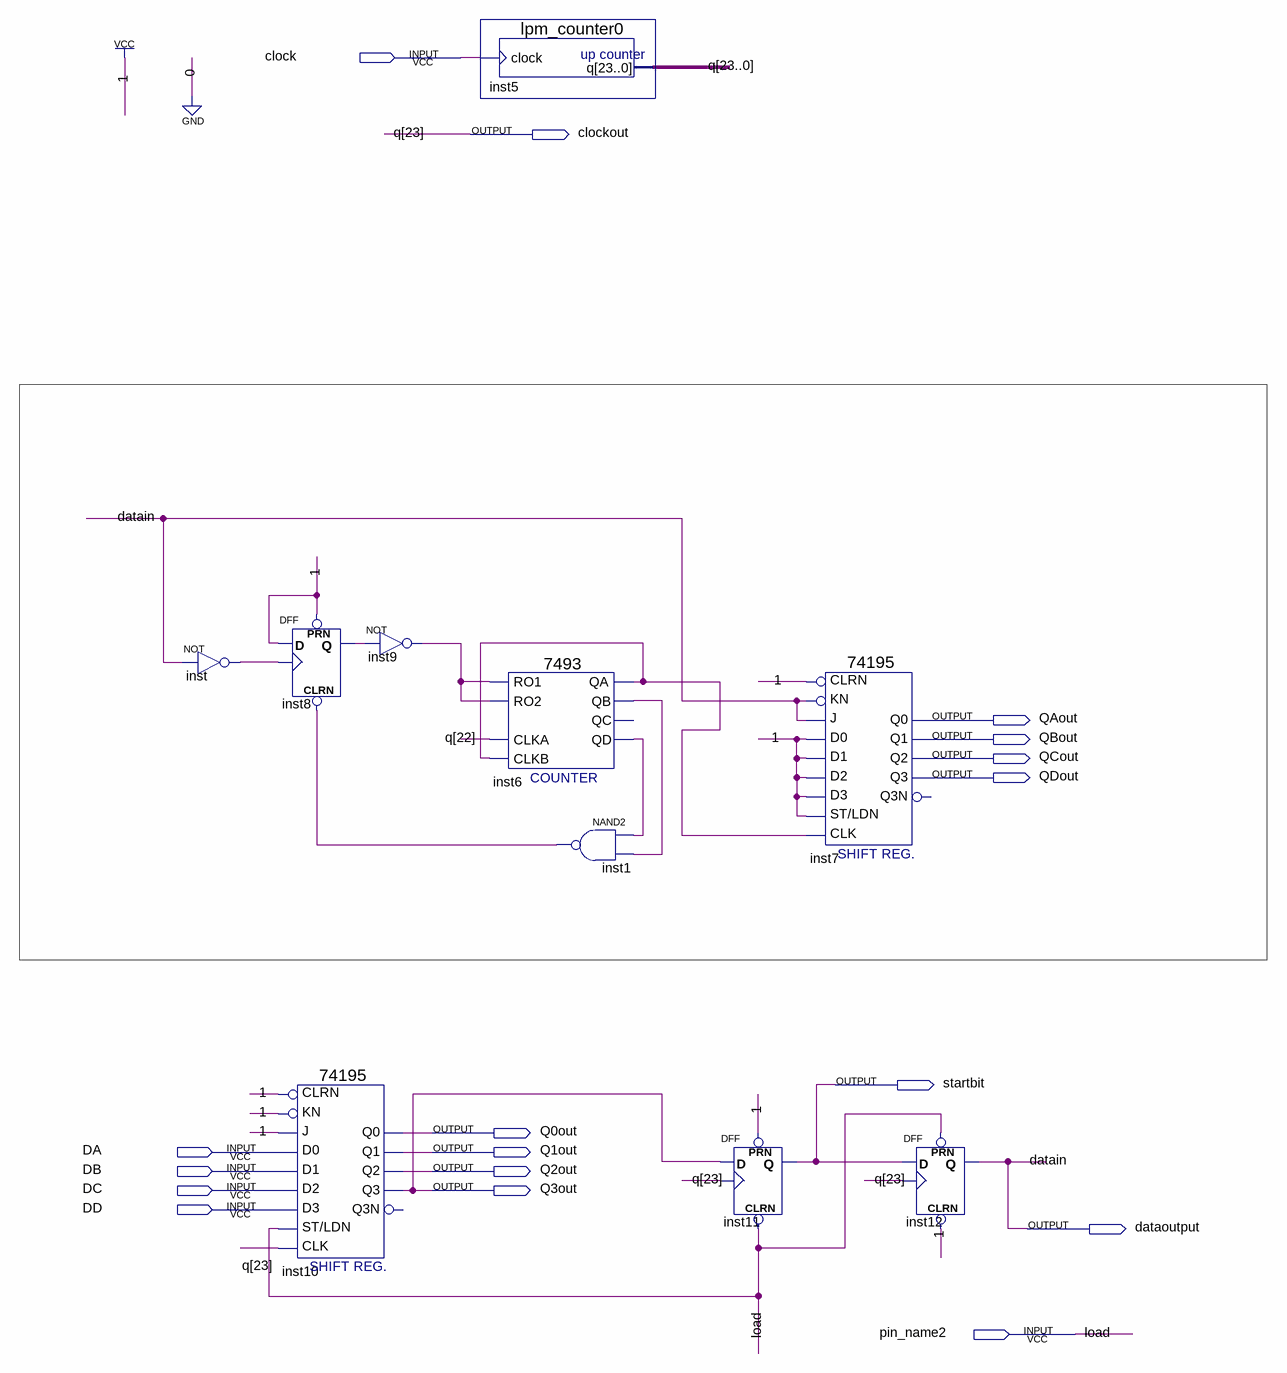
[diagram p0: schematic sheet]
// Quartus schematic Test5part3.bdf as structural Verilog: 10 symbols, 17 pins
module Test5part3 (
  input  clock,
  input  DA,
  input  DB,
  input  DC,
  input  DD,
  input  pin_name2,
  output clockout,
  output QAout,
  output QBout,
  output QCout,
  output QDout,
  output startbit,
  output Q0out,
  output Q1out,
  output Q2out,
  output Q3out,
  output dataoutput
);

  wire inst1_out, inst6_qa, inst6_qb, inst6_qd, inst8_q, inst9_out, inst_out;
  wire [22:0] q;

  not inst (inst_out, dataoutput);
  DFF inst8 (.CLRN(inst1_out), .CLK(inst_out), .D(1'b1), .PRN(1'b1), .Q(inst8_q));
  \74195  inst10 (
    .\ST/LDN (pin_name2), .KN(1'b1), .CLRN(1'b1), .D2(DC), .D1(DB), .D0(DA), .J(1'b1), .CLK(clockout),
    .D3(DD), .Q3(Q3out), .Q0(Q0out), .Q1(Q1out), .Q2(Q2out));  // open: Q3N
  not inst9 (inst9_out, inst8_q);
  lpm_counter0 inst5 (.clock(clock), .q({clockout, q}));
  \7493  inst6 (
    .RO1(inst9_out), .RO2(inst9_out), .CLKA(q[22]), .CLKB(inst6_qa), .QB(inst6_qb), .QA(inst6_qa),
    .QD(inst6_qd));  // open: QC
  nand inst1 (inst1_out, inst6_qd, inst6_qb);
  DFF inst11 (.CLRN(pin_name2), .CLK(clockout), .D(Q3out), .PRN(1'b1), .Q(startbit));
  \74195  inst7 (
    .\ST/LDN (1'b1), .KN(dataoutput), .CLRN(1'b1), .D2(1'b1), .D1(1'b1), .D0(1'b1), .J(dataoutput),
    .CLK(inst6_qa), .D3(1'b1), .Q3(QDout), .Q0(QAout), .Q1(QBout), .Q2(QCout));  // open: Q3N
  DFF inst12 (.CLRN(1'b1), .CLK(clockout), .D(startbit), .PRN(pin_name2), .Q(dataoutput));

  // Other names for the same wires on the sheet: datain = dataoutput; load = pin_name2; q[23] = clockout
endmodule
